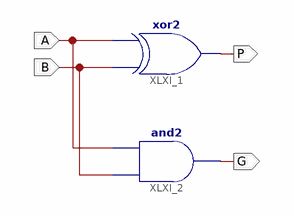
[diagram p0: schematic sheet 1]
// Xilinx ISE schematic GPG.sch (spartan3e) as structural Verilog: 2 symbols, 4 ports
module GPG (
  input  A,
  input  B,
  output P,
  output G
);

  xor XLXI_1 (P, B, A);
  and XLXI_2 (G, B, A);
endmodule
